# Altium schematic sheet Sheet3.SchDoc
size A
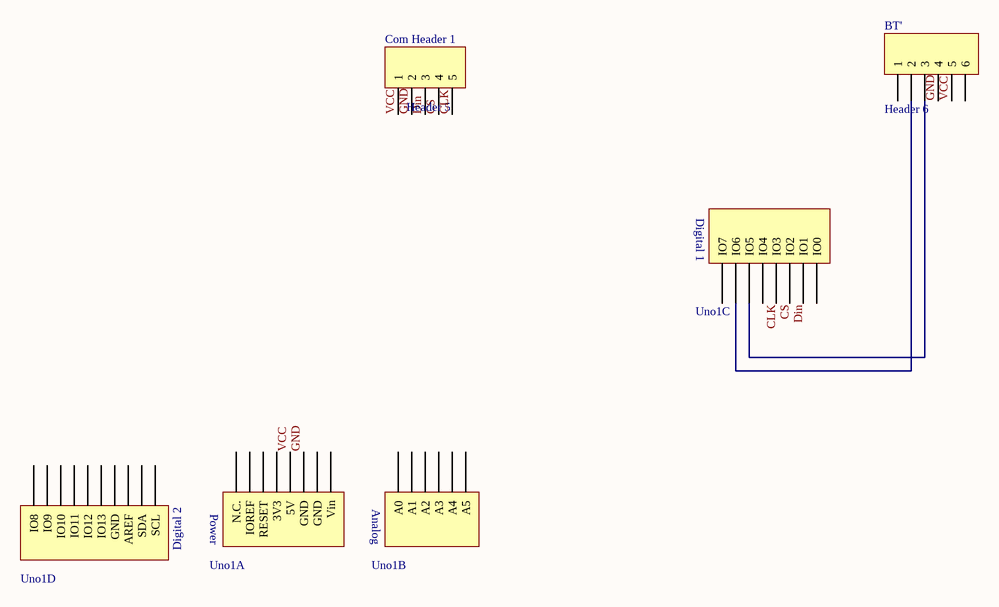
[diagram p0: Sheet3.SchDoc]

## Parts
BT'  Header 6  [HDR1X6]
Com_Header_1  Header 5  [HDR1X5]
Uno1  Arduino Uno  [Arduino Uno]  (value not drawn)  (parts A,B,C,D of 5)

## Nets
CLK: Com_Header_1.5 Uno1.4(IO4)
CS: Com_Header_1.4 Uno1.3(IO3)
Din: Com_Header_1.3 Uno1.2(IO2)
GND: BT'.4 Com_Header_1.2 Uno1.GND1(GND)
VCC: BT'.5 Com_Header_1.1 Uno1.5V
NetBT'_2: BT'.2 Uno1.6(IO6)
NetBT'_3: BT'.3 Uno1.5(IO5)

Not connected (* = marked no-connect by the designer): BT' 1 6; Uno1 0(IO0) 1(IO1) 3V3 7(IO7) 8(IO8) 9(IO9) 10(IO10) 11(IO11) 12(IO12) 13(IO13) A0 A1 A2 A3 A4 A5 AREF GND2(GND) GND3(GND) IOREF NC(N.C.) RESET SCL SDA Vin

## Notes on the sheet
- (in symbol Arduino Uno, part A) Power
- (in symbol Arduino Uno, part B) Analog
- (in symbol Arduino Uno, part C) Digital 1
- (in symbol Arduino Uno, part D) Digital 2

## Library data of the parts
BT' = Header 6: Header, 6-Pin; LatestRevisionDate: 17-Jul-2002; LatestRevisionNote: Re-released for DXP Platform.; Publisher: Altium Limited
Com_Header_1 = Header 5: Header, 5-Pin; LatestRevisionDate: 17-Jul-2002; LatestRevisionNote: Re-released for DXP Platform.; Publisher: Altium Limited